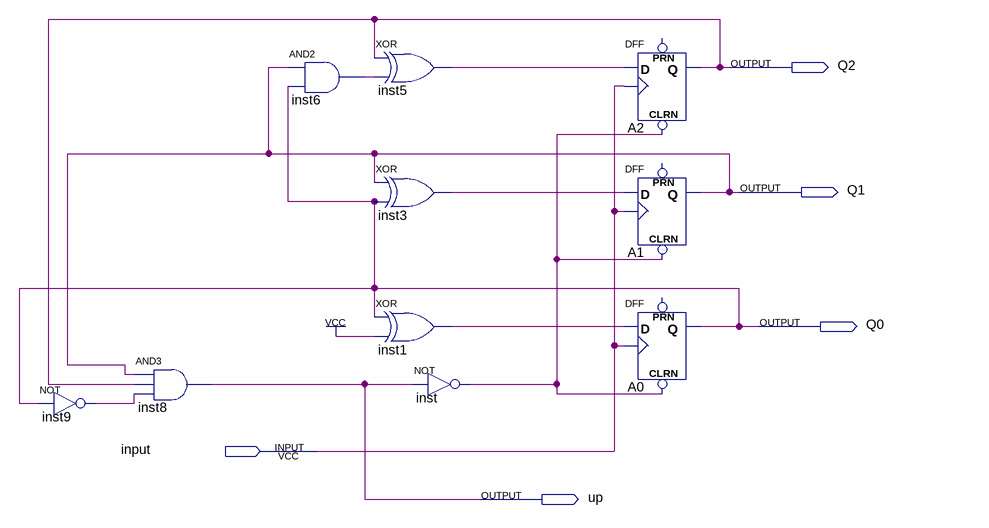
[diagram p0: schematic sheet]
// Quartus schematic mod6.bdf as structural Verilog: 10 symbols, 5 pins
module mod6 (
  input  \input ,
  output Q2,
  output Q1,
  output Q0,
  output up
);

  wire inst1_out, inst3_out, inst5_out, inst6_out, inst9_out, inst_out;

  not inst9 (inst9_out, Q0);
  and inst8 (up, Q1, Q2, inst9_out);
  and inst6 (inst6_out, Q1, Q0);
  xor inst5 (inst5_out, Q2, inst6_out);
  xor inst3 (inst3_out, Q1, Q0);
  xor inst1 (inst1_out, Q0, 1'b1);
  not inst (inst_out, up);
  DFF A2 (.CLRN(inst_out), .CLK(\input ), .D(inst5_out), .Q(Q2));  // open: PRN
  DFF A1 (.CLRN(inst_out), .CLK(\input ), .D(inst3_out), .Q(Q1));  // open: PRN
  DFF A0 (.CLRN(inst_out), .CLK(\input ), .D(inst1_out), .Q(Q0));  // open: PRN
endmodule
